# EAGLE design R613B (EAGLE 6.6.0)
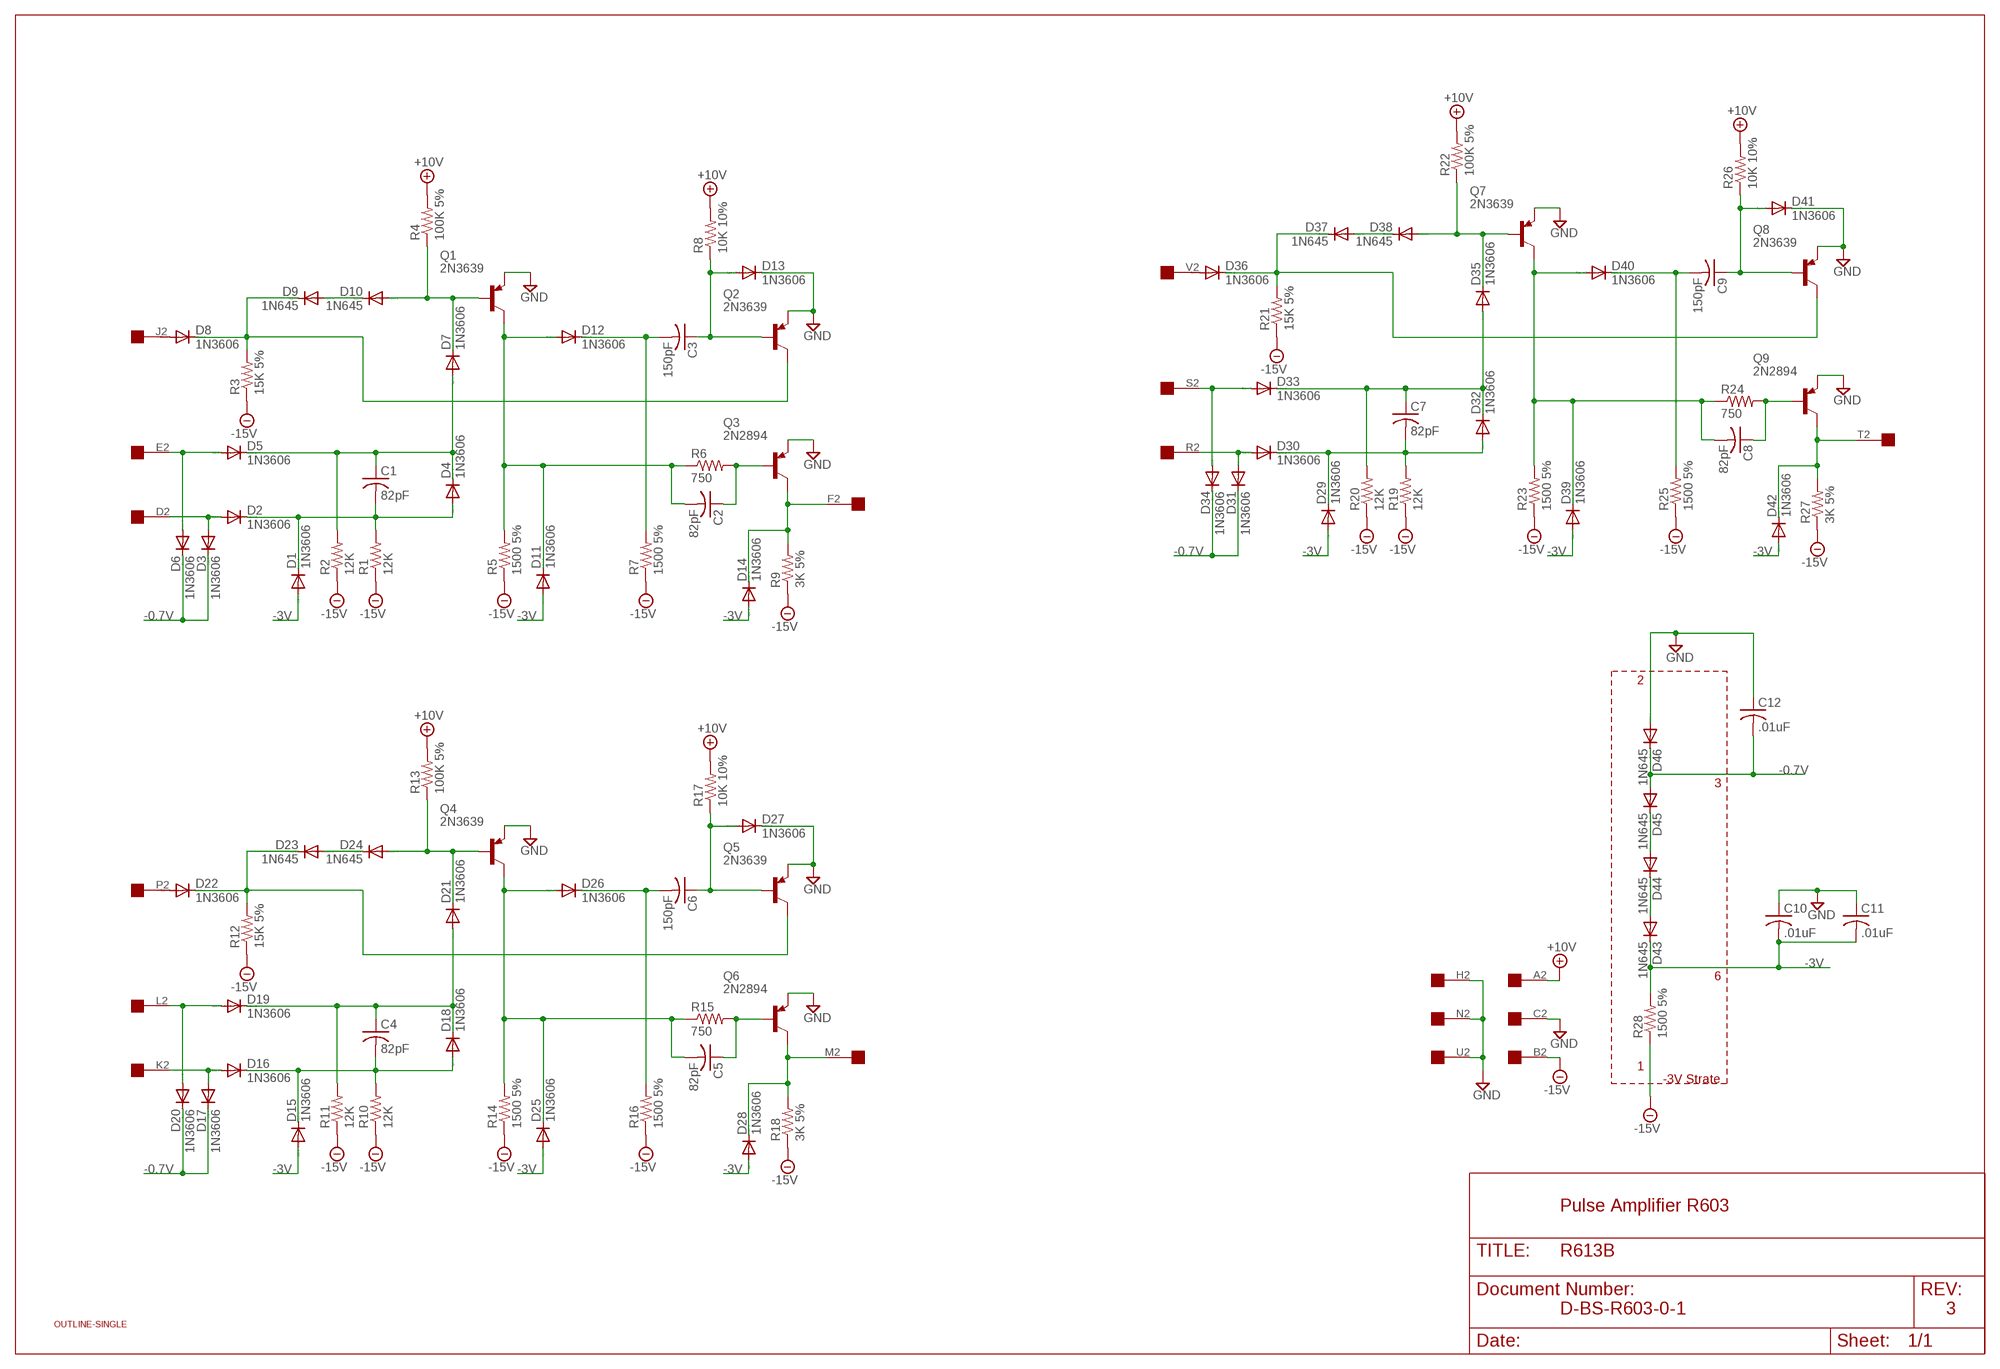
[diagram p0: schematic, sheet 1]

## Parts
C1  82pF  C-US050-025X075  [C050-025X075]
C2  82pF  C-US050-025X075  [C050-025X075]
C3  150pF  C-US050-025X075  [C050-025X075]
C4  82pF  C-US050-025X075  [C050-025X075]
C5  82pF  C-US050-025X075  [C050-025X075]
C6  150pF  C-US050-025X075  [C050-025X075]
C7  82pF  C-US050-025X075  [C050-025X075]
C8  82pF  C-US050-025X075  [C050-025X075]
C9  150pF  C-US050-025X075  [C050-025X075]
C10  .01uF  C-US050-025X075  [C050-025X075]
C11  .01uF  C-US050-025X075  [C050-025X075]
C12  .01uF  C-US050-025X075  [C050-025X075]
D1  1N3606  1N4148DO35-10  [DO35-10]
D2  1N3606  1N4148DO35-10  [DO35-10]
D3  1N3606  1N4148DO35-10  [DO35-10]
D4  1N3606  1N4148DO35-10  [DO35-10]
D5  1N3606  1N4148DO35-10  [DO35-10]
D6  1N3606  1N4148DO35-10  [DO35-10]
D7  1N3606  1N4148DO35-10  [DO35-10]
D8  1N3606  1N4148DO35-10  [DO35-10]
D9  1N645  1N4148DO35-10  [DO35-10]
D10  1N645  1N4148DO35-10  [DO35-10]
D11  1N3606  1N4148DO35-10  [DO35-10]
D12  1N3606  1N4148DO35-10  [DO35-10]
D13  1N3606  1N4148DO35-10  [DO35-10]
D14  1N3606  1N4148DO35-10  [DO35-10]
D15  1N3606  1N4148DO35-10  [DO35-10]
D16  1N3606  1N4148DO35-10  [DO35-10]
D17  1N3606  1N4148DO35-10  [DO35-10]
D18  1N3606  1N4148DO35-10  [DO35-10]
D19  1N3606  1N4148DO35-10  [DO35-10]
D20  1N3606  1N4148DO35-10  [DO35-10]
D21  1N3606  1N4148DO35-10  [DO35-10]
D22  1N3606  1N4148DO35-10  [DO35-10]
D23  1N645  1N4148DO35-10  [DO35-10]
D24  1N645  1N4148DO35-10  [DO35-10]
D25  1N3606  1N4148DO35-10  [DO35-10]
D26  1N3606  1N4148DO35-10  [DO35-10]
D27  1N3606  1N4148DO35-10  [DO35-10]
D28  1N3606  1N4148DO35-10  [DO35-10]
D29  1N3606  1N4148DO35-10  [DO35-10]
D30  1N3606  1N4148DO35-10  [DO35-10]
D31  1N3606  1N4148DO35-10  [DO35-10]
D32  1N3606  1N4148DO35-10  [DO35-10]
D33  1N3606  1N4148DO35-10  [DO35-10]
D34  1N3606  1N4148DO35-10  [DO35-10]
D35  1N3606  1N4148DO35-10  [DO35-10]
D36  1N3606  1N4148DO35-10  [DO35-10]
D37  1N645  1N4148DO35-10  [DO35-10]
D38  1N645  1N4148DO35-10  [DO35-10]
D39  1N3606  1N4148DO35-10  [DO35-10]
D40  1N3606  1N4148DO35-10  [DO35-10]
D41  1N3606  1N4148DO35-10  [DO35-10]
D42  1N3606  1N4148DO35-10  [DO35-10]
D43  1N645  1N4148DO35-10  [DO35-10]
D44  1N645  1N4148DO35-10  [DO35-10]
D45  1N645  1N4148DO35-10  [DO35-10]
D46  1N645  1N4148DO35-10  [DO35-10]
Q1  2N3639  2N2904  [TO39]
Q2  2N3639  2N2904  [TO39]
Q3  2N2894  2N2904  [TO39]
Q4  2N3639  2N2904  [TO39]
Q5  2N3639  2N2904  [TO39]
Q6  2N2894  2N2904  [TO39]
Q7  2N3639  2N2904  [TO39]
Q8  2N3639  2N2904  [TO39]
Q9  2N2894  2N2904  [TO39]
R1  12K  R-US_0207/10  [0207/10]
R2  12K  R-US_0207/10  [0207/10]
R3  15K 5%  R-US_0207/10  [0207/10]
R4  100K 5%  R-US_0207/10  [0207/10]
R5  1500 5%  R-US_0207/10  [0207/10]
R6  750  R-US_0207/10  [0207/10]
R7  1500 5%  R-US_0207/10  [0207/10]
R8  10K 10%  R-US_0207/10  [0207/10]
R9  3K 5%  R-US_0207/10  [0207/10]
R10  12K  R-US_0207/10  [0207/10]
R11  12K  R-US_0207/10  [0207/10]
R12  15K 5%  R-US_0207/10  [0207/10]
R13  100K 5%  R-US_0207/10  [0207/10]
R14  1500 5%  R-US_0207/10  [0207/10]
R15  750  R-US_0207/10  [0207/10]
R16  1500 5%  R-US_0207/10  [0207/10]
R17  10K 10%  R-US_0207/10  [0207/10]
R18  3K 5%  R-US_0207/10  [0207/10]
R19  12K  R-US_0207/10  [0207/10]
R20  12K  R-US_0207/10  [0207/10]
R21  15K 5%  R-US_0207/10  [0207/10]
R22  100K 5%  R-US_0207/10  [0207/10]
R23  1500 5%  R-US_0207/10  [0207/10]
R24  750  R-US_0207/10  [0207/10]
R25  1500 5%  R-US_0207/10  [0207/10]
R26  10K 10%  R-US_0207/10  [0207/10]
R27  3K 5%  R-US_0207/10  [0207/10]
R28  1500 5%  R-US_0207/10  [0207/10]
U$1  OUTLINE-SINGLE  [SINGLE]
U$2  EDGE-1  [EDGE-CON1]

## Nets
+10V [Supply]: R4.2 R8.2 R13.2 R17.2 R22.2 R26.2 U$2.A2
-0.7V [Supply]: C12.2 D3.C D6.C D17.C D20.C D31.C D34.C D45.A D46.C
-3V [Supply]: C10.2 C11.2 D1.A D11.A D14.A D15.A D25.A D28.A D29.A D39.A D42.A D43.C R28.2
-15V [Supply]: R1.1 R2.1 R3.1 R5.1 R7.1 R9.1 R10.1 R11.1 R12.1 R14.1 R16.1 R18.1 R19.1 R20.1 R21.1 R23.1 R25.1 R27.1 R28.1 U$2.B2
GND [Supply]: C10.1 C11.1 C12.1 D13.C D27.C D41.C D46.A Q1.1(E) Q2.1(E) Q3.1(E) Q4.1(E) Q5.1(E) Q6.1(E) Q7.1(E) Q8.1(E) Q9.1(E) U$2.C2 U$2.H2 U$2.N2 U$2.U2
N$1: D8.A U$2.J2
N$2: D8.C D9.C Q2.3(C) R3.2
N$3: D5.A D6.A U$2.E2
N$4: D2.A D3.A U$2.D2
N$5: C1.1 D4.C D5.C D7.A R2.2
N$6: C1.2 D1.C D2.C D4.A R1.2
N$7: D9.A D10.C
N$8 [Supply]: D44.A D45.C
N$9 [Supply]: D43.A D44.C
N$10: D7.C D10.A Q1.2(B) R4.1
N$11: C2.2 D11.C D12.A Q1.3(C) R5.2 R6.1
N$12: C3.2 D12.C R7.2
N$13: C3.1 D13.A Q2.2(B) R8.1
N$14: D14.C Q3.3(C) R9.2 U$2.F2
N$15: D19.A D20.A U$2.L2
N$16: D16.A D17.A U$2.K2
N$17: C4.1 D18.C D19.C D21.A R11.2
N$18: C4.2 D15.C D16.C D18.A R10.2
N$19: D33.A D34.A U$2.S2
N$20: D30.A D31.A U$2.R2
N$21: C7.1 D32.C D33.C D35.A R20.2
N$22: C7.2 D29.C D30.C D32.A R19.2
N$23: D36.A U$2.V2
N$24: D36.C D37.C Q8.3(C) R21.2
N$25: D37.A D38.C
N$26: D35.C D38.A Q7.2(B) R22.1
N$27: D22.C D23.C Q5.3(C) R12.2
N$28: D28.C Q6.3(C) R18.2 U$2.M2
N$29: C5.1 Q6.2(B) R15.2
N$30: C5.2 D25.C D26.A Q4.3(C) R14.2 R15.1
N$31: D22.A U$2.P2
N$33: D23.A D24.C
N$34: D21.C D24.A Q4.2(B) R13.1
N$35: C6.2 D26.C R16.2
N$36: C8.2 D39.C D40.A Q7.3(C) R23.2 R24.1
N$38: C6.1 D27.A Q5.2(B) R17.1
N$40: C2.1 Q3.2(B) R6.2
N$43: D42.C Q9.3(C) R27.2 U$2.T2
N$44: C8.1 Q9.2(B) R24.2
N$46: C9.2 D40.C R25.2
N$47: C9.1 D41.A Q8.2(B) R26.1

## Notes on the sheet
- 2
- 3
- 6
- 1
- -3V Strate
- Pulse Amplifier R603
- D-BS-R603-0-1 | 3

## Library data of the parts
C1-C12 = rcl:C-US: CAPACITOR, American symbol
D1-D46 = diode:1N4148: DIODE high speed (Philips)
Q1-Q9 = transistor-pnp:2N2904*: PNP Transistror
R1-R28 = rcl:R-US_: RESISTOR, American symbol
U$1 = dec-con:OUTLINE-*: Board outlines for DEC boards.
U$2 = dec-con:EDGE-1: Single-Sided DEC Edge Connector -- (side 2)

## Net classes
1 Supply: width 0.813 mm

## Board
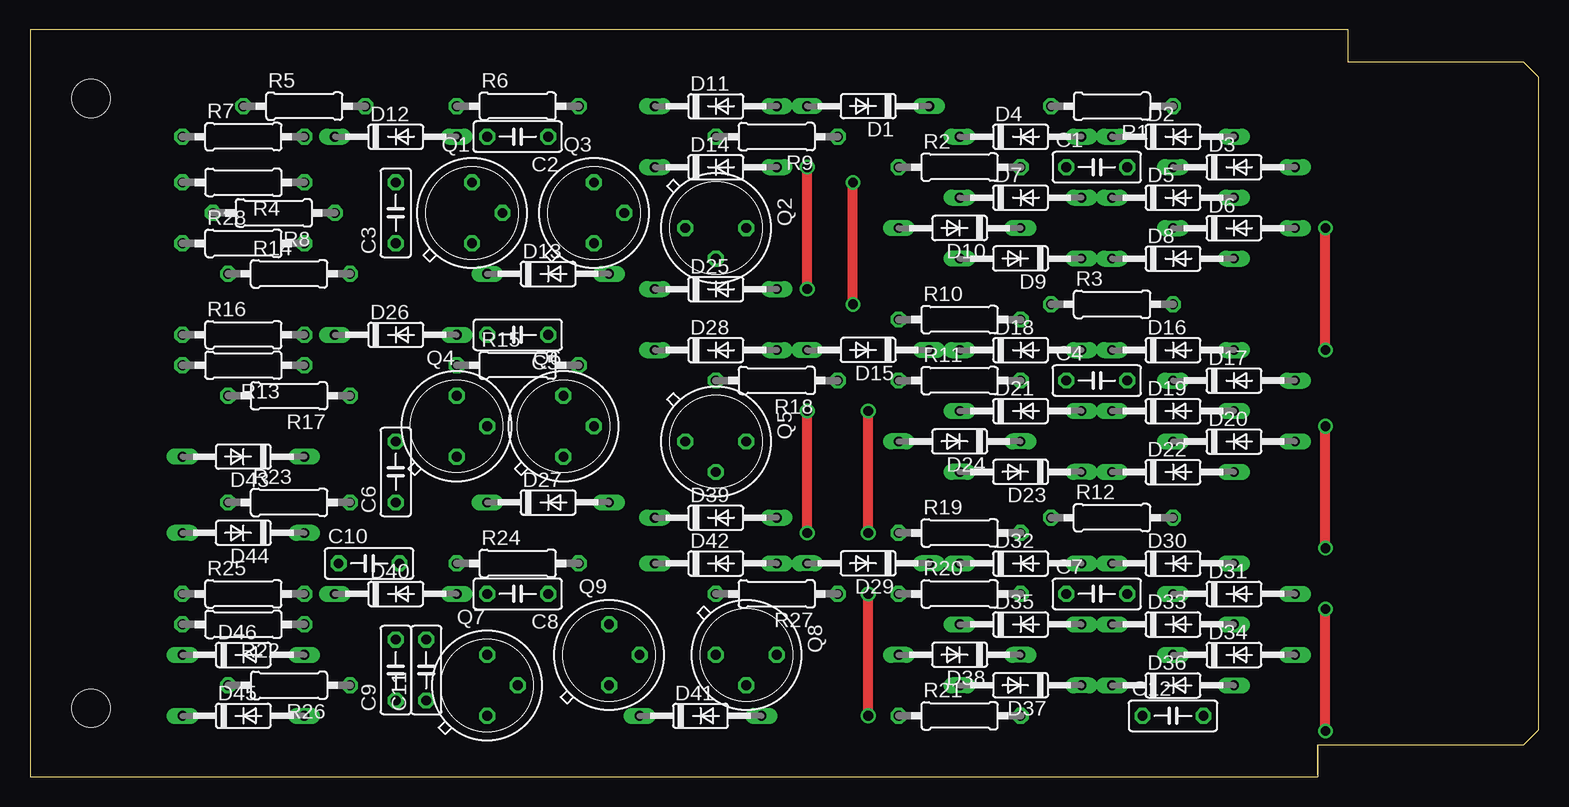
[diagram p1: board, top side]
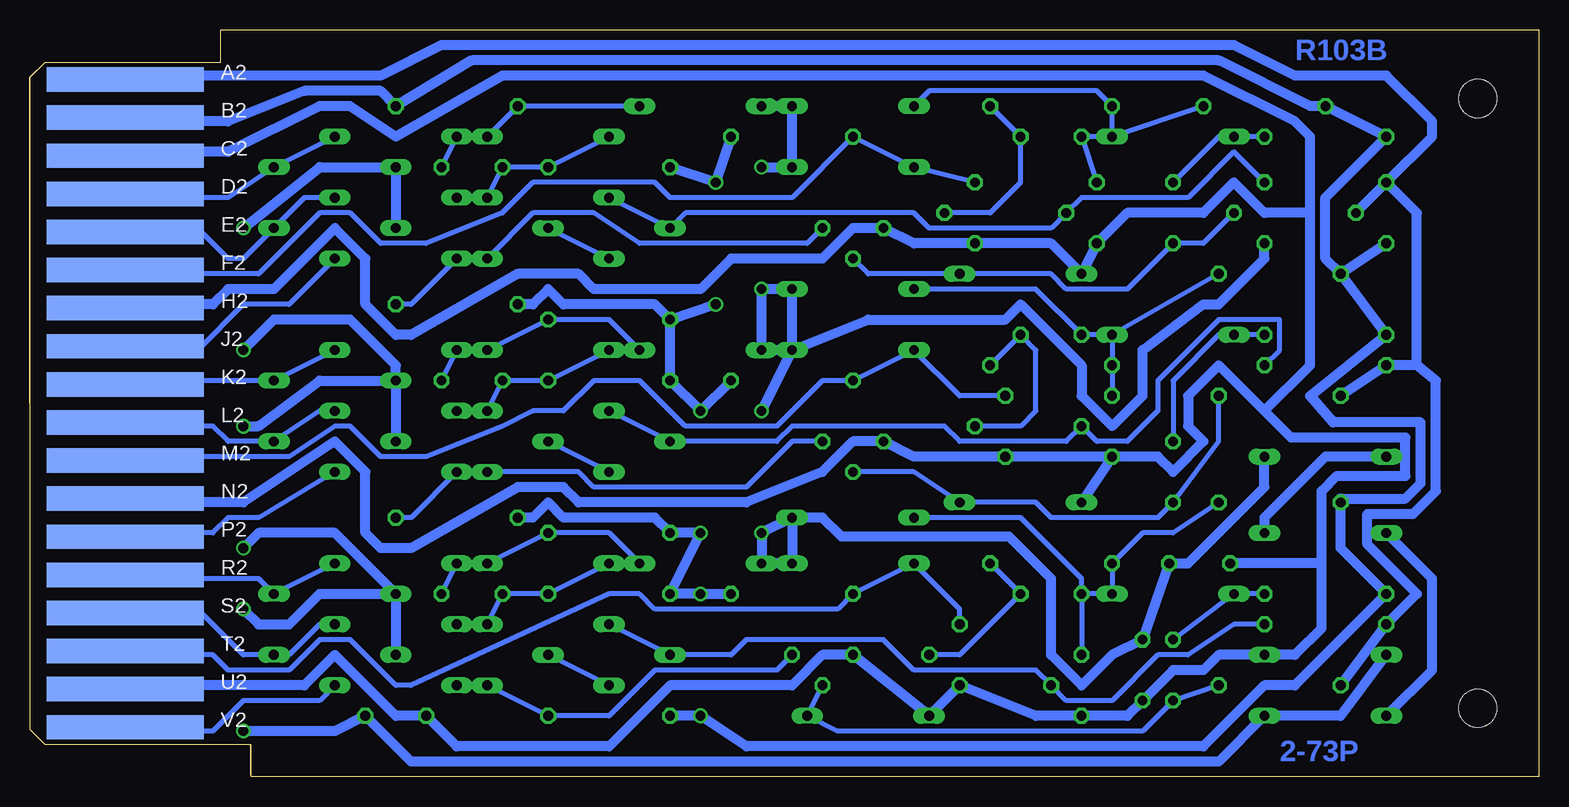
[diagram p2: board, bottom side, seen from below]

Size 125.73 x 62.23 mm. Coordinates in mm from the lower left corner, seen from the top.
Copper layers (1+16): Top 0.035mm / dielectric 1.5mm / Bottom 0.035mm
Design rules "16mils": minimum track width 16mil, minimum drill 32mil, track to track 15mil, track to pad 10mil, pad to pad 10mil, via to via 10mil, smd to smd 10mil, copper to edge 13mil, drill to drill 10mil, minimum pad ring 10mil, minimum via ring 8mil, stop-mask expansion 0mil, vias tented up to drill 0mil, thermal gap 10mil

### Footprints (pad centres in the part's own frame; a part is rotated, then mirrored left to right if it is on the bottom)
C050-025X075 = drill 0.813 octagon: 1 -2.54,0; 2 2.54,0
DO35-10 = drill 0.813 long: A 5.08,0; C -5.08,0
TO39 = drill 0.813 octagon: 1 0,-2.54; 2 2.54,0; 3 0,2.54
0207/10 = drill 0.813 octagon: 1 -5.08,0; 2 5.08,0
SINGLE = hole 3.175: 120.65,56.515; 120.65,5.715
EDGE-CON1 = smd 13.106 x 2.032 bottom: A2 7.938,4.128; B2 7.938,7.303; C2 7.938,10.477; D2 7.938,13.652; E2 7.938,16.828; F2 7.938,20.003; H2 7.938,23.177; J2 7.938,26.352; K2 7.938,29.527; L2 7.938,32.703; M2 7.938,35.877; N2 7.938,39.053; P2 7.938,42.227; R2 7.938,45.403; S2 7.938,48.578; T2 7.938,51.752; U2 7.938,54.928; V2 7.938,58.102

### Placement (x,y rotation side)
C1  88.9,50.8 0 top
C2  40.64,53.34 180 top
C3  30.48,46.99 90 top
C4  88.9,33.02 0 top
C5  40.64,36.83 180 top
C6  30.48,25.4 90 top
C7  88.9,15.24 0 top
C8  40.64,15.24 180 top
C9  30.48,8.89 90 top
C10  28.26,17.78 0 top
C11  33.02,8.89 90 top
C12  95.25,5.08 0 top
D1  69.85,55.88 180 top
D2  95.25,53.34 0 top
D3  100.33,50.8 0 top
D4  82.55,53.34 0 top
D5  95.25,48.26 0 top
D6  100.33,45.72 0 top
D7  82.55,48.26 0 top
D8  95.25,43.18 0 top
D9  82.55,43.18 180 top
D10  77.47,45.72 180 top
D11  57.15,55.88 0 top
D12  30.48,53.34 0 top
D13  43.18,41.91 0 top
D14  57.15,50.8 0 top
D15  69.85,35.56 180 top
D16  95.25,35.56 0 top
D17  100.33,33.02 0 top
D18  82.55,35.56 0 top
D19  95.25,30.48 0 top
D20  100.33,27.94 0 top
D21  82.55,30.48 0 top
D22  95.25,25.4 0 top
D23  82.55,25.4 180 top
D24  77.47,27.94 180 top
D25  57.15,40.64 0 top
D26  30.48,36.83 0 top
D27  43.18,22.86 0 top
D28  57.15,35.56 0 top
D29  69.85,17.78 180 top
D30  95.25,17.78 0 top
D31  100.33,15.24 0 top
D32  82.55,17.78 0 top
D33  95.25,12.7 0 top
D34  100.33,10.16 0 top
D35  82.55,12.7 0 top
D36  95.25,7.62 0 top
D37  82.55,7.62 180 top
D38  77.47,10.16 180 top
D39  57.15,21.59 0 top
D40  30.48,15.24 0 top
D41  55.88,5.08 0 top
D42  57.15,17.78 0 top
D43  17.78,26.67 180 top
D44  17.78,20.32 180 top
D45  17.78,5.08 0 top
D46  17.78,10.16 0 top
Q1  36.83,46.99 0 top
Q2  57.15,45.72 270 top
Q3  46.99,46.99 0 top
Q4  35.56,29.21 0 top
Q5  57.15,27.94 270 top
Q6  44.45,29.21 0 top
Q7  38.1,7.62 0 top
Q8  59.69,10.16 270 top
Q9  48.26,10.16 0 top
R1  90.17,55.88 180 top
R2  77.47,50.8 0 top
R3  90.17,39.37 0 top
R4  17.78,49.53 180 top
R5  22.86,55.88 0 top
R6  40.64,55.88 0 top
R7  17.78,53.34 0 top
R8  20.32,46.99 180 top
R9  62.23,53.34 180 top
R10  77.47,38.1 0 top
R11  77.47,33.02 0 top
R12  90.17,21.59 0 top
R13  17.78,34.29 180 top
R14  21.59,41.91 0 top
R15  40.64,34.29 0 top
R16  17.78,36.83 0 top
R17  21.59,31.75 180 top
R18  62.23,33.02 180 top
R19  77.47,20.32 0 top
R20  77.47,15.24 0 top
R21  77.47,5.08 0 top
R22  17.78,12.7 180 top
R23  21.59,22.86 0 top
R24  40.64,17.78 0 top
R25  17.78,15.24 0 top
R26  21.59,7.62 180 top
R27  62.23,15.24 180 top
R28  17.78,44.45 0 top
U$1  125.73,62.23 180 top
U$2  125.73,62.23 180 top

### Tracks (layer width: path | path; a pad name or v marks a point on that pad's centre or on a via)
+10V
  Bottom 0.813: U$2.A2 116.84,58.42 96.52,58.42 91.44,60.96 25.4,60.96 20.32,58.42 12.7,58.42 8.89,54.61 8.89,53.34 R4.2 | R4.2 R8.2 | R17.2 R13.2 10.16,34.29 | R26.2 R22.2 10.16,15.24 14.29,19.37 14.29,21.91 10.48,21.91 8.57,23.81 8.57,33.02 10.16,34.29 | 10.16,34.29 10.16,46.99 R4.2
-0.7V  (via drill 0.81)
  Top 0.813: v107.95,35.56 v107.95,45.72 | v107.95,19.05 v107.95,29.21 | v107.95,3.81 v107.95,13.97
  Bottom 0.813: v107.95,13.97 106.68,12.7 104.14,12.7 101.6,15.24 D31.C | D31.C 100.33,20.32 106.68,20.32 v107.95,19.05 | v107.95,29.21 106.68,29.21 101.6,33.02 D17.C | D17.C 95.25,34.29 99.06,38.1 105.41,38.1 v107.95,35.56 | D6.C D3.C 101.6,50.8 v107.95,45.72 | D17.C D20.C | D31.C D34.C | v107.95,3.81 100.33,3.81 C12.2 93.98,1.27 26.67,1.27 D45.A 16.51,5.08 D46.C
-3V  (via drill 0.81)
  Top 0.813: v64.77,20.32 v64.77,30.48 | v64.77,40.64 v64.77,50.8
  Bottom 0.813: D28.A D25.A v64.77,40.64 D15.A D28.A | v64.77,30.48 D28.A | D28.A 55.88,38.1 44.45,38.1 43.18,39.37 38.1,34.29 38.1,31.75 35.56,29.21 33.02,31.75 33.02,35.56 27.94,39.37 26.67,39.37 22.86,43.18 R28.2 | v64.77,50.8 D14.A D11.A D1.A | D39.A v64.77,20.32 D29.A D42.A D39.A | D43.C 22.86,24.13 29.21,17.78 C10.2 C11.2 35.56,10.16 38.1,7.62 40.64,10.16 40.64,16.51 44.13,20 58.1,20 59.69,21.59 D39.A
-15V  (via drill 0.81)
  Top 0.813: v69.85,20.32 v69.85,30.48 | v68.58,39.37 v68.58,49.53 | v69.85,5.08 v69.85,15.24
  Bottom 0.813: R10.1 R11.1 v69.85,30.48 R18.1 | U$2.B2 116.84,54.61 109.22,54.61 102.87,57.15 96.52,57.15 R1.1 88.9,59.69 26.67,59.69 19.05,55.88 R5.1 R7.1 17.78,48.26 17.78,43.18 R14.1 | R21.1 v69.85,5.08 66.04,2.54 27.94,2.54 22.86,7.62 20.32,7.62 R25.1 16.51,19.05 R23.1 16.51,23.18 11.11,23.18 9.84,24.45 9.84,29.53 17.14,29.53 19.05,31.75 R16.1 R14.1 | R10.1 v68.58,39.37 | R12.1 83.82,21.59 82.55,22.86 81.28,21.59 73.66,21.59 R19.1 v69.85,20.32 R20.1 v69.85,15.24 R27.1 | R10.1 73.66,39.37 81.28,39.37 82.55,40.64 83.82,39.37 R3.1 | R2.1 v68.58,49.53 R9.1 | R14.1 R28.1
GND
  Bottom 0.813: U$2.C2 116.84,52.07 109.22,52.07 101.6,55.88 99.06,55.88 95.25,53.34 86.36,58.42 27.94,58.42 20.32,54.61 19.05,53.34 19.05,46.99 | U$2.N2 116.84,22.86 107.95,22.86 100.33,27.94 97.79,25.4 97.79,20.32 96.52,19.05 93.98,19.05 85.09,24.13 81.28,24.13 80.01,22.86 66.04,22.86 59.69,25.4 57.15,27.94 Q5.1 52.07,26.67 Q6.1 Q4.1 | U$2.U2 116.84,7.62 102.87,7.62 100.33,10.16 95.25,5.08 C12.1 90.17,2.54 77.47,2.54 72.39,7.62 62.23,7.62 59.69,10.16 Q8.1 D41.C Q9.1 41.91,5.08 Q7.1 34.29,5.08 C11.1 30.48,8.89 27.94,8.89 26.67,10.16 D46.A 20.32,10.16 18.1,12.38 18.1,17.78 | U$2.H2 116.84,39.37 110.49,39.37 109.22,40.64 105.41,40.64 100.33,45.72 97.79,43.18 97.79,39.37 95.25,36.83 93.98,36.83 85.09,41.91 80.01,41.91 78.74,40.64 69.85,40.64 67.31,43.18 59.69,43.18 57.15,45.72 Q2.1 52.07,44.45 Q3.1 40.64,44.45 D13.C | Q1.1 D13.C | Q4.1 D27.C | Q1.1 D13.C | 18.1,17.78 C10.1 | 18.1,17.78 18.1,23.81 16.83,25.08 11.11,25.08 11.11,28.26 20.64,28.26 | 20.64,28.26 22.86,30.48 19.05,34.29 19.05,46.99 | Q4.1 31.75,26.67 30.48,25.4 27.94,27.94 29.21,29.21 29.21,31.75 26.67,34.29 20.64,28.26 | Q1.1 34.29,46.99 27.94,46.99 25.4,49.53 22.86,46.99 19.05,46.99
N$1
  Bottom 0.406: U$2.J2 116.84,35.56 111.76,35.56 107.95,39.37 104.14,39.37 D8.A
N$2
  Bottom 0.406: R3.2 93.98,39.37 D8.C D9.C 83.82,46.99 78.74,46.99 74.93,44.45 60.96,44.45 Q2.3
N$3
  Bottom 0.406: U$2.E2 116.84,45.72 111.76,45.72 109.22,43.18 107.95,43.18 D6.A 102.87,48.26 D5.A
N$4
  Bottom 0.406: D2.A D3.A 109.22,48.26 116.84,48.26 U$2.D2
N$5
  Bottom 0.406: D5.C D7.A C1.1 R2.2 D4.C
N$6
  Bottom 0.406: C1.2 D2.C D4.A R1.2 D1.C
N$7
  Bottom 0.406: D9.A D10.C
N$8
  Bottom 0.813: D45.C 8.89,8.89 8.89,16.51 D44.A
N$9
  Bottom 0.813: D43.A 17.78,26.67 22.86,21.59 D44.C
N$10
  Bottom 0.406: D7.C D10.A 71.12,46.99 52.07,46.99 50.8,45.72 40.64,45.72 Q1.2 38.1,48.26 29.21,48.26 25.4,52.07 R4.1
N$11
  Bottom 0.406: D11.C 50.8,57.15 36.83,57.15 R6.1 | D12.A R6.1 | D12.A C2.2 Q1.3 | D12.A R6.1 | R5.2 D12.A
N$12
  Bottom 0.406: R7.2 D12.C 26.67,53.34 C3.2
N$13
  Bottom 0.406: R8.1 27.94,44.45 C3.1 34.29,40.64 39.37,40.64 40.64,41.91 D13.A 55.88,41.91 Q2.2
N$14
  Bottom 0.406: U$2.F2 116.84,41.91 106.68,41.91 101.6,46.99 99.06,46.99 96.52,44.45 92.71,44.45 86.36,46.99 83.82,49.53 73.66,49.53 72.39,48.26 62.23,48.26 R9.2 D14.C Q3.3
N$15
  Bottom 0.406: U$2.L2 116.84,29.21 110.49,29.21 109.22,27.94 D20.A 101.6,30.48 D19.A
N$16
  Bottom 0.406: U$2.K2 117.14,32.72 116.84,33.02 D17.A D16.A
N$17
  Bottom 0.406: D19.C D21.A C4.1 R11.2 D18.C
N$18
  Bottom 0.406: D15.C 77.47,38.1 R10.2 D18.A D16.C C4.2
N$19
  Bottom 0.406: U$2.S2 116.84,13.97 111.76,13.97 107.95,10.16 D34.A 104.14,10.16 101.6,12.7 D33.A
N$20
  Bottom 0.406: D30.A D31.A 106.68,16.51 116.84,16.51 U$2.R2
N$21
  Bottom 0.406: D32.C R20.2 C7.1 D35.A D33.C
N$22
  Bottom 0.406: C7.2 D30.C D32.A R19.2 77.47,20.32 D29.C
N$23
  Bottom 0.406: U$2.V2 116.84,3.81 110.49,3.81 107.95,6.35 101.6,6.35 D36.A
N$24
  Bottom 0.406: D36.C D37.C R21.2 77.47,5.08 73.66,8.89 63.5,8.89 Q8.3
N$25
  Bottom 0.406: D37.A D38.C
N$26
  Bottom 0.406: D35.C D38.A 67.31,10.16 66.04,11.43 54.61,11.43 52.07,8.89 41.91,8.89 Q7.2 39.37,6.35 35.56,6.35 31.75,10.16 29.21,10.16 25.4,12.7 R22.1
N$27
  Bottom 0.406: R12.2 93.98,21.59 D22.C D23.C 80.01,25.4 78.74,24.13 66.04,24.13 62.23,27.94 Q5.3
N$28
  Bottom 0.406: U$2.M2 116.84,26.67 104.14,26.67 100.33,29.21 99.06,29.21 96.52,26.67 92.71,26.67 86.36,29.21 83.82,30.48 81.28,30.48 78.74,33.02 74.93,33.02 71.12,29.21 63.5,29.21 59.69,33.02 R18.2 D28.C 48.26,31.75 Q6.3
N$29
  Bottom 0.406: Q6.2 43.18,29.21 41.91,30.48 41.91,35.56 C5.1 R15.2
N$30
  Bottom 0.406: D26.A R15.1 | D26.A C5.2 41.91,40.64 D25.C | R15.1 Q4.3 | D26.A R15.1 | R14.2 D26.A
N$31
  Bottom 0.406: U$2.P2 116.84,20.32 110.49,20.32 109.22,21.59 106.68,21.59 D22.A
N$33
  Bottom 0.406: D23.A D24.C
N$34
  Bottom 0.406: D21.C D24.A 63.5,27.94 62.23,29.21 49.53,29.21 48.26,27.94 39.37,27.94 Q4.2 36.83,27.94 34.29,27.94 31.75,30.48 31.75,33.02 26.67,38.1 21.59,38.1 21.59,35.56 R13.1
N$35
  Bottom 0.406: C6.2 30.48,33.02 26.67,36.83 D26.C R16.2
N$36
  Bottom 0.406: C8.2 Q7.3 | D39.C 43.18,21.59 38.1,16.51 C8.2 | R23.2 30.48,20.32 33.02,20.32 R24.1 D40.A C8.2
N$38
  Bottom 0.406: Q5.2 52.07,25.4 D27.A 41.91,22.86 40.64,21.59 31.75,21.59 C6.1 26.67,27.94 R17.1
N$40
  Bottom 0.406: R6.2 C2.1 43.18,49.53 45.72,46.99 Q3.2
N$43
  Bottom 0.406: U$2.T2 116.84,10.16 110.49,10.16 109.22,8.89 104.14,8.89 101.6,11.43 99.06,11.43 95.25,7.62 93.98,7.62 77.47,15.24 74.93,15.24 73.66,13.97 58.42,13.97 R27.2 D42.C 48.26,13.97 Q9.3
N$44
  Bottom 0.406: Q9.2 48.26,10.16 C8.1 R24.2
N$46
  Bottom 0.406: R25.2 D40.C C9.2
N$47
  Bottom 0.406: Q8.2 D41.A 58.42,3.81 33.02,3.81 C9.1 R26.1

### Text on the board
Bottom: R103B | 2-73P